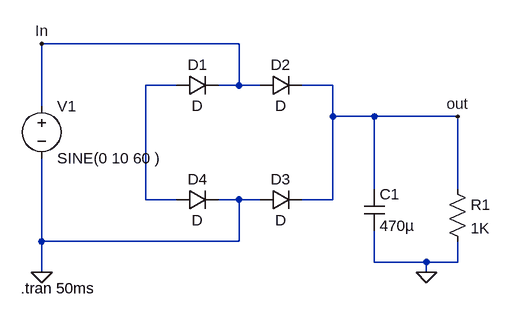
[diagram p0: schematic 3.asc]
3.asc, the LTspice schematic file:
Version 4.1
SHEET 1 880 680
WIRE 272 16 -32 16
WIRE 176 80 128 80
WIRE 272 80 272 16
WIRE 272 80 240 80
WIRE 304 80 272 80
WIRE 416 80 368 80
WIRE -32 112 -32 16
WIRE 416 128 416 80
WIRE 480 128 416 128
WIRE 608 128 480 128
WIRE 480 240 480 128
WIRE 608 240 608 128
WIRE 128 256 128 80
WIRE 176 256 128 256
WIRE 272 256 240 256
WIRE 304 256 272 256
WIRE 416 256 416 128
WIRE 416 256 368 256
WIRE -32 320 -32 192
WIRE 272 320 272 256
WIRE 272 320 -32 320
WIRE 480 352 480 304
WIRE 560 352 480 352
WIRE 608 352 608 320
WIRE 608 352 560 352
WIRE -32 368 -32 320
WIRE 560 368 560 352
FLAG -32 368 0
FLAG 560 368 0
FLAG -32 16 In
FLAG 608 128 out
SYMBOL voltage -32 96 R0
SYMATTR InstName V1
SYMATTR Value SINE(0 10 60 )
SYMBOL diode 176 96 R270
WINDOW 0 32 32 VTop 2
WINDOW 3 0 32 VBottom 2
SYMATTR InstName D1
SYMBOL diode 304 96 R270
WINDOW 0 32 32 VTop 2
WINDOW 3 0 32 VBottom 2
SYMATTR InstName D2
SYMBOL diode 304 272 R270
WINDOW 0 32 32 VTop 2
WINDOW 3 0 32 VBottom 2
SYMATTR InstName D3
SYMBOL diode 176 272 R270
WINDOW 0 32 32 VTop 2
WINDOW 3 0 32 VBottom 2
SYMATTR InstName D4
SYMBOL cap 464 240 R0
SYMATTR InstName C1
SYMATTR Value 470µ
SYMBOL res 592 224 R0
SYMATTR InstName R1
SYMATTR Value 1K
TEXT -64 392 Left 2 !.tran 50ms

The netlist it stands for:
* 3.asc
V1 In 0 SINE(0 10 60 )
D1 N001 In D
D2 In out D
D3 0 out D
D4 N001 0 D
C1 out 0 470µ
R1 out 0 1K
.model D D
.lib standard.dio
.tran 50ms
.backanno
.end